# EAGLE design DevelopmentBoard_08M2 (EAGLE 6.4)
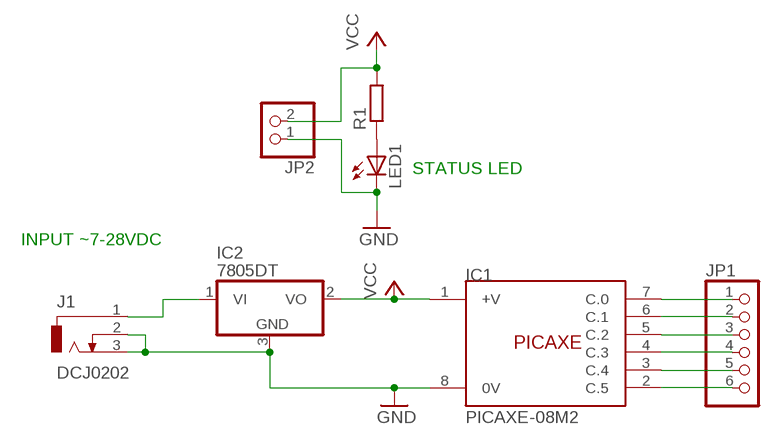
[diagram p0: schematic, sheet 1]

## Parts
IC1  PICAXE-08M2  [SOIC8]
IC2  7805DT  [TO252]
J1  DCJ0202  [DCJ0202]
JP1  PINHD-1X6  [1X06]
JP2  PINHD-1X2  [1X02]
LED1  LEDCHIPLED_1206  [CHIPLED_1206]
R1  R-EU_R1206  [R1206]

## Nets
GND: IC1.8(0V) IC2.3(GND) J1.2 J1.3 JP2.1 LED1.C
N$1: IC2.1(VI) J1.1
N$2: LED1.A R1.1
N$3: IC1.7(C.0) JP1.1
N$4: IC1.6(C.1) JP1.2
N$5: IC1.5(C.2) JP1.3
N$6: IC1.4(C.3) JP1.4
N$7: IC1.3(C.4) JP1.5
N$8: IC1.2(C.5) JP1.6
VCC: IC1.1(+V) IC2.2(VO) JP2.2 R1.2

## Notes on the sheet
- STATUS LED
- INPUT ~7-28VDC

## Library data of the parts
IC1 = apex:PICAXE-08M2
IC2 = linear:78*: Positive VOLTAGE REGULATOR Source: http://cache.national.com/ds/LM/LM78L05.pdf http://www.fairchildsemi.com/ds/LM/LM7805.pdf
J1 = con-jack:DCJ0202: DC POWER JACK Source: DCJ0202.pdf; OC_FARNELL: unknown; OC_NEWARK: unknown
JP1 = pinhead:PINHD-1X6: PIN HEADER
JP2 = pinhead:PINHD-1X2: PIN HEADER
LED1 = led:LED: LED OSRAM: - CHIPLED LG R971, LG N971, LY N971, LG Q971, LY Q971, LO R971, LY R971 LH N974, LH R974 LS Q976, LO Q976, LY Q976 LO Q996 - Hyper CHIPLED LW Q18S LB Q993, LB Q99A, LB R99A - SideLED LS A670, LO A670, LY A670, LG A670, LP A670 LB A673, LV A673, LT A673, LW A673 LH A674 LY A675 LS A676, LA A676, LO A676, LY A676, LW A676 LS A679, LY A679, LG A679 - Hyper Micro SIDELED® LS Y876, LA Y876, LO Y876, LY Y876 LT Y87S - SmartLED LW L88C, LW L88S LB L89C, LB L89S, LG L890 LS L89K, LO L89K, LY L89K LS L896, LA L896, LO L896, LY L896 - TOPLED LS T670, LO T670, LY T670, LG T670, LP T670 LSG T670, LSP T670, LSY T670, LOP T670, LYG T670 LG T671, LOG T671, LSG T671 LB T673, LV T673, LT T673, LW T673 LH T674 LS T676, LA T676, LO T676, LY T676, LB T676, LH T676, LSB T676, LW T676 LB T67C, LV T67C, LT T67C, LS T67K, LO T67K, LY T67K, LW E67C LS E67B, LA E67B, LO E67B, LY E67B, LB E67C, LV E67C, LT E67C LW T67C LS T679, LY T679, LG T679 LS T770, LO T770, LY T770, LG T770, LP T770 LB T773, LV T773, LT T773, LW T773 LH T774 LS E675, LA E675, LY E675, LS T675 LS T776, LA T776, LO T776, LY T776, LB T776 LHGB T686 LT T68C, LB T68C - Hyper Mini TOPLED® LB M676 - Mini TOPLED Santana® LG M470 LS M47K, LO M47K, LY M47K Source: http://www.osram.convergy.de LUXEON: - LUMILED® LXK2-PW12-R00, LXK2-PW12-S00, LXK2-PW14-U00, LXK2-PW14-V00 LXK2-PM12-R00, LXK2-PM12-S00, LXK2-PM14-U00 LXK2-PE12-Q00, LXK2-PE12-R00, LXK2-PE12-S00, LXK2-PE14-T00, LXK2-PE14-U00 LXK2-PB12-K00, LXK2-PB12-L00, LXK2-PB12-M00, LXK2-PB14-N00, LXK2-PB14-P00, LXK2-PB14-Q00 LXK2-PR12-L00, LXK2-PR12-M00, LXK2-PR14-Q00, LXK2-PR14-R00 LXK2-PD12-Q00, LXK2-PD12-R00, LXK2-PD12-S00 LXK2-PH12-R00, LXK2-PH12-S00 LXK2-PL12-P00, LXK2-PL12-Q00, LXK2-PL12-R00 Source: www.luxeon.com KINGBRIGHT: KA-3528ASYC Source: www.kingbright.com
R1 = rcl:R-EU_: RESISTOR, European symbol

## Board
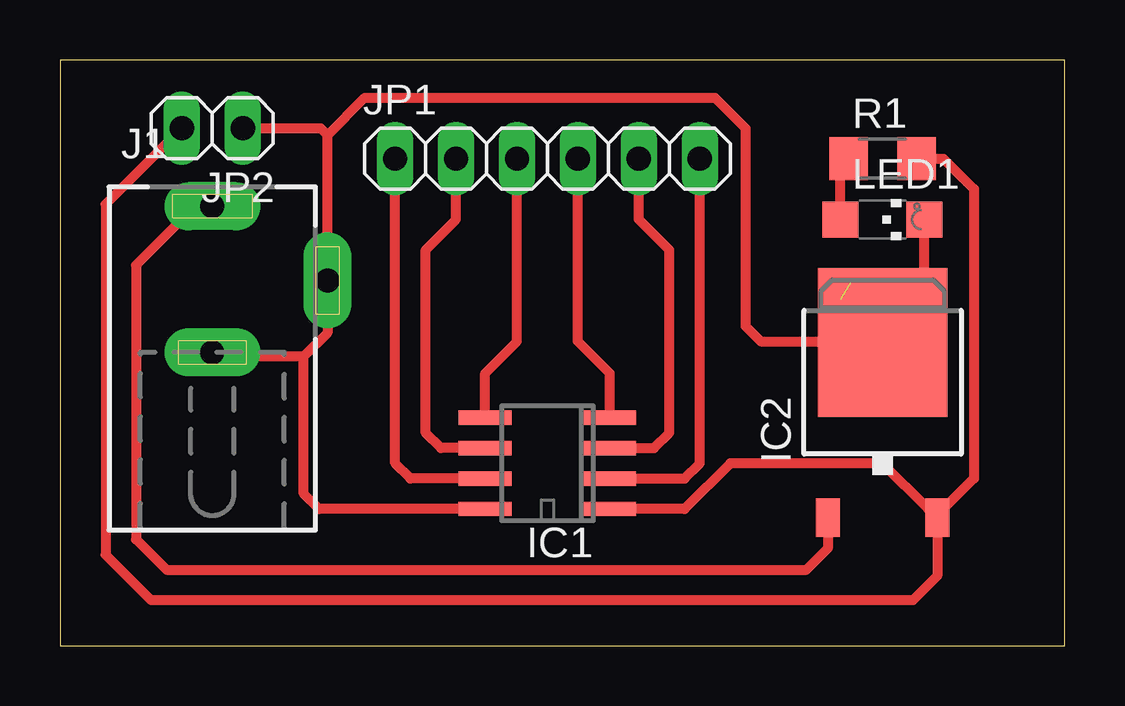
[diagram p1: board, top side]

Size 41.89 x 24.43 mm. Coordinates in mm from the lower left corner, seen from the top.
Outline: 0,0 41.89,0 41.89,24.43 0,24.43 0,0
Copper layers (1*16): Top 0.035mm / dielectric 1.5mm / Bottom 0.035mm
Design rules "default": minimum track width 10mil, minimum drill 24mil, track to track 8mil, track to pad 8mil, pad to pad 8mil, via to via 8mil, smd to smd 8mil, copper to edge 40mil, drill to drill 8mil, minimum pad ring 10mil, minimum via ring 8mil, stop-mask expansion 4mil, vias tented up to drill 0mil, thermal gap 10mil

### Footprints (pad centres in the part's own frame; a part is rotated, then mirrored left to right if it is on the bottom)
SOIC8 = smd 0.6 x 2.2: 1 -1.905,-2.6; 2 -0.635,-2.6; 3 0.635,-2.6; 4 1.905,-2.6; 5 1.905,2.6; 6 0.635,2.6; 7 -0.635,2.6; 8 -1.905,2.6
TO252 = smd 1 x 1.6: 1 -2.28,-4.8; 2 2.28,-4.8 | smd 5.4 x 6.2: 3 0,2.5
DCJ0202 = drill 1 pad 2 long: 1 0,3.1; 2 4.8,0; 3 0,-3
1X06 = drill 1.016 long: 1 -6.35,0; 2 -3.81,0; 3 -1.27,0; 4 1.27,0; 5 3.81,0; 6 6.35,0
1X02 = drill 1.016 long: 1 -1.27,0; 2 1.27,0
CHIPLED_1206 = smd 1.5 x 1.5: A 0,-1.75; C 0,1.75
R1206 = smd 1.6 x 1.803: 1 -1.422,0; 2 1.422,0

### Placement (x,y rotation side)
IC1  20.32,7.62 90 top
IC2  34.29,10.16 0 top
J1  6.35,15.24 0 top
JP1  20.32,20.32 0 top
JP2  6.35,21.59 180 top
LED1  34.29,17.78 270 top
R1  34.29,20.32 0 top

### Tracks (layer width: path | path; a pad name or v marks a point on that pad's centre or on a via)
GND  (1 unrouted)
  Top 0.406: 10.16,12.07 11.15,13.05 J1.2 11.15,21.31 | 10.16,12.07 6.53,12.07 J1.3 | IC1.8 10.79,5.71 10.16,6.35 10.16,12.07 | 34.29,12.7 34.29,13.97 33.02,15.24 | 33.02,13.97 32.54,14.45 36.04,14.45 LED1.C | 11.15,21.31 12.7,22.86 27.3,22.86 28.57,21.59 28.57,13.34 29.21,12.7 34.29,12.7 | 34.29,12.7 IC2.3 | JP2.1 10.87,21.59 11.15,21.31
N$1
  Top 0.406: J1.1 5.64,18.34 3.17,15.88 3.17,4.45 4.45,3.17 31.11,3.17 32.01,4.07 IC2.1
N$2
  Top 0.406: LED1.A 32.54,19.99 R1.1
N$3
  Top 0.406: IC1.7 14.61,6.98 13.97,7.62 JP1.1
N$4
  Top 0.406: IC1.6 15.88,8.26 15.24,8.89 15.24,16.51 16.51,17.78 JP1.2
N$5
  Top 0.406: IC1.5 17.72,11.37 19.05,12.7 JP1.3
N$6
  Top 0.406: IC1.4 22.92,11.37 21.59,12.7 JP1.4
N$7
  Top 0.406: IC1.3 24.77,8.26 25.4,8.89 25.4,16.51 24.13,17.78 JP1.5
N$8
  Top 0.406: IC1.2 26.04,6.98 26.67,7.62 JP1.6
VCC
  Top 0.406: 36.2,5.71 36.55,5.36 IC2.2 36.57,2.92 35.56,1.91 3.81,1.91 1.91,3.81 1.91,18.41 JP2.2 | 36.2,5.71 34.29,7.62 27.94,7.62 26.04,5.71 IC1.1 | R1.2 36.83,20.32 38.1,19.05 38.1,6.98 36.83,5.71 36.2,5.71